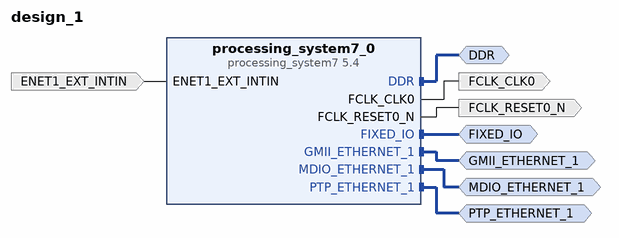
[diagram p0: block diagram of the top level]
# Vivado block design design_1, Vivado 2014.2
create_bd_design design_1

create_bd_intf_port -mode Master -vlnv xilinx.com:interface:ddrx_rtl:1.0 DDR
create_bd_intf_port -mode Master -vlnv xilinx.com:display_processing_system7:fixedio_rtl:1.0 FIXED_IO
create_bd_intf_port -mode Master -vlnv xilinx.com:interface:gmii_rtl:1.0 GMII_ETHERNET_1
create_bd_intf_port -mode Master -vlnv xilinx.com:interface:mdio_rtl:1.0 MDIO_ETHERNET_1
create_bd_intf_port -mode Master -vlnv xilinx.com:interface:ptp_rtl:1.0 PTP_ETHERNET_1
create_bd_port -dir O -type clk FCLK_CLK0
create_bd_port -dir O -type rst FCLK_RESET0_N
create_bd_port -dir I -type intr ENET1_EXT_INTIN

create_bd_cell -type ip -vlnv xilinx.com:ip:processing_system7:5.4 processing_system7_0
set_property -dict [list \
  CONFIG.PCW_USE_M_AXI_GP0 0 \
  CONFIG.PCW_IMPORT_BOARD_PRESET /scratch/skarandikar/ps7_system_prj.xml \
  CONFIG.PCW_QSPI_GRP_SINGLE_SS_ENABLE 0 \
  CONFIG.preset {ZC706*} \
] [get_bd_cells processing_system7_0]
# 1 more settings of processing_system7_0 are not shown: defaults, MIO pin electricals, DDR timing, and values the tool derives

# ---- connections ----

connect_bd_intf_net [get_bd_intf_ports DDR] [get_bd_intf_pins processing_system7_0/DDR]
connect_bd_intf_net [get_bd_intf_ports FIXED_IO] [get_bd_intf_pins processing_system7_0/FIXED_IO]
connect_bd_intf_net [get_bd_intf_ports GMII_ETHERNET_1] [get_bd_intf_pins processing_system7_0/GMII_ETHERNET_1]
connect_bd_intf_net [get_bd_intf_ports MDIO_ETHERNET_1] [get_bd_intf_pins processing_system7_0/MDIO_ETHERNET_1]
connect_bd_intf_net [get_bd_intf_ports PTP_ETHERNET_1] [get_bd_intf_pins processing_system7_0/PTP_ETHERNET_1]
connect_bd_net [get_bd_pins processing_system7_0/FCLK_CLK0] [get_bd_ports FCLK_CLK0]
connect_bd_net [get_bd_pins processing_system7_0/FCLK_RESET0_N] [get_bd_ports FCLK_RESET0_N]
connect_bd_net [get_bd_ports ENET1_EXT_INTIN] [get_bd_pins processing_system7_0/ENET1_EXT_INTIN]

validate_bd_design
save_bd_design
